# EAGLE design d1mini-sw (EAGLE 8.5.0)
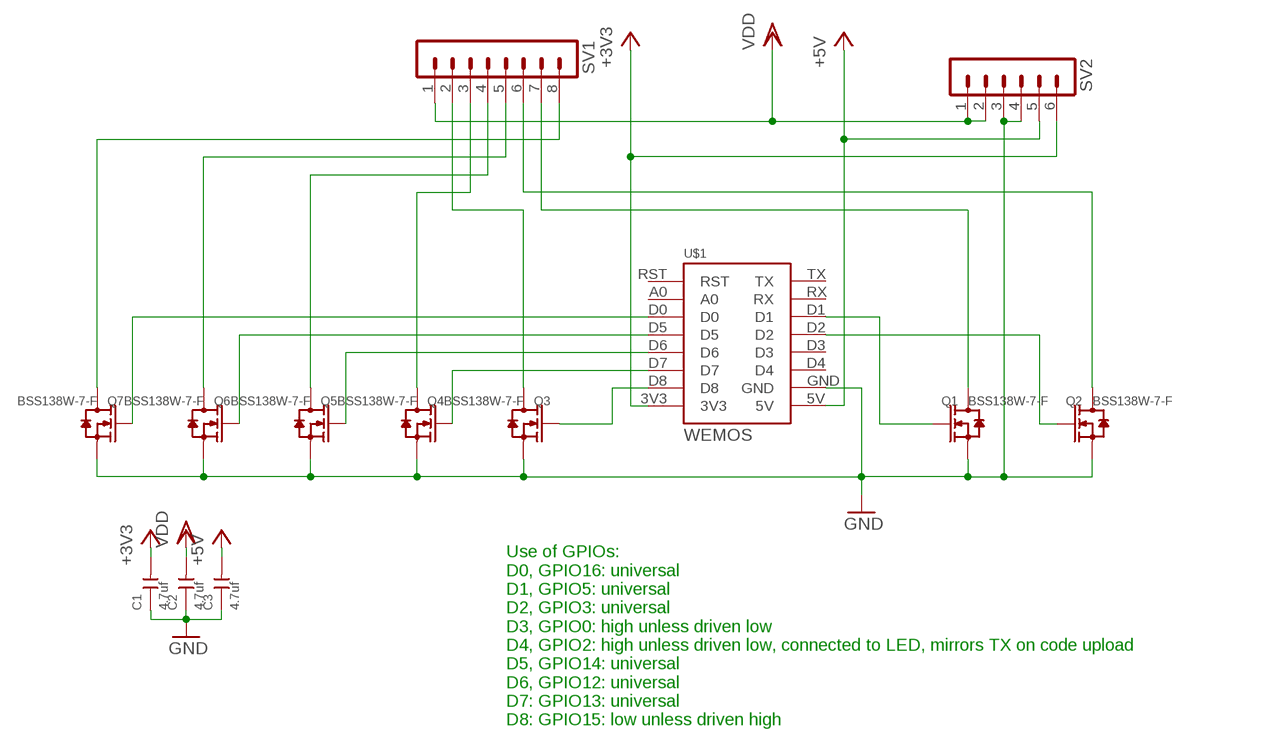
[diagram p0: schematic, sheet 1]

## Parts
C1  4.7uf  CERAMIC-4.7UF-25V-10%-X5R(0805)  [C0805]
C2  4.7uf  CERAMIC-4.7UF-25V-10%-X5R(0805)  [C0805]
C3  4.7uf  CERAMIC-4.7UF-25V-10%-X5R(0805)  [C0805]
Q1  BSS138W-7-F  SMD-MOSFET-N-CH-50V-200MA-BSS138W-7-F(SOT-23)  [SOT-23]
Q2  BSS138W-7-F  SMD-MOSFET-N-CH-50V-200MA-BSS138W-7-F(SOT-23)  [SOT-23]
Q3  BSS138W-7-F  SMD-MOSFET-N-CH-50V-200MA-BSS138W-7-F(SOT-23)  [SOT-23]
Q4  BSS138W-7-F  SMD-MOSFET-N-CH-50V-200MA-BSS138W-7-F(SOT-23)  [SOT-23]
Q5  BSS138W-7-F  SMD-MOSFET-N-CH-50V-200MA-BSS138W-7-F(SOT-23)  [SOT-23]
Q6  BSS138W-7-F  SMD-MOSFET-N-CH-50V-200MA-BSS138W-7-F(SOT-23)  [SOT-23]
Q7  BSS138W-7-F  SMD-MOSFET-N-CH-50V-200MA-BSS138W-7-F(SOT-23)  [SOT-23]
SV1  MA08-1  [MA08-1]
SV2  MA06-1  [MA06-1]
U$1  WEMOS  [WEMOS]

## Nets
+3V3: C1.2 SV2.6 U$1.3V3
+5V: C3.2 SV2.5 U$1.5V
D0: Q7.1(G) U$1.D0
D1: Q1.1(G) U$1.D1
D2: Q2.1(G) U$1.D2
D5: Q6.1(G) U$1.D5
D6: Q5.1(G) U$1.D6
D7: Q4.1(G) U$1.D7
D8: Q3.1(G) U$1.D8
GND: C1.1 C2.1 C3.1 Q1.2(S) Q2.2(S) Q3.2(S) Q4.2(S) Q5.2(S) Q6.2(S) Q7.2(S) SV2.3 SV2.4 U$1.GND
P0: Q7.3(D) SV1.8
P1: Q1.3(D) SV1.7
P2: Q2.3(D) SV1.6
P5: Q6.3(D) SV1.5
P6: Q5.3(D) SV1.4
P7: Q4.3(D) SV1.3
P8: Q3.3(D) SV1.2
VDD: C2.2 SV1.1 SV2.1 SV2.2
Unconnected: U$1.A0 U$1.D3 U$1.D4 U$1.RST U$1.RX U$1.TX

## Notes on the sheet
- Use of GPIOs:
  D0, GPIO16: universal
  D1, GPIO5: universal
  D2, GPIO3: universal
  D3, GPIO0: high unless driven low
  D4, GPIO2: high unless driven low, connected to LED, mirrors TX on code upload
  D5, GPIO14: universal
  D6, GPIO12: universal
  D7: GPIO13: universal
  D8: GPIO15: low unless driven high

## Library data of the parts
C1-C3 = Seeed-Capacitor-2016:CERAMIC-4.7UF-25V-10%-X5R(0805): 302010146; MPN: CC0805KKX5R8BB475
Q1-Q7 = Seeed-Transistor-2016:SMD-MOSFET-N-CH-50V-200MA-BSS138W-7-F(SOT-23): 305030000; MPN: BSS138W-7-F
SV1 = con-lstb:MA08-1: PIN HEADER; OC_FARNELL: unknown; OC_NEWARK: unknown
SV2 = con-lstb:MA06-1: PIN HEADER; OC_FARNELL: unknown; OC_NEWARK: unknown
U$1 = WeMos D1 Mini Pro:WEMOS

## Board
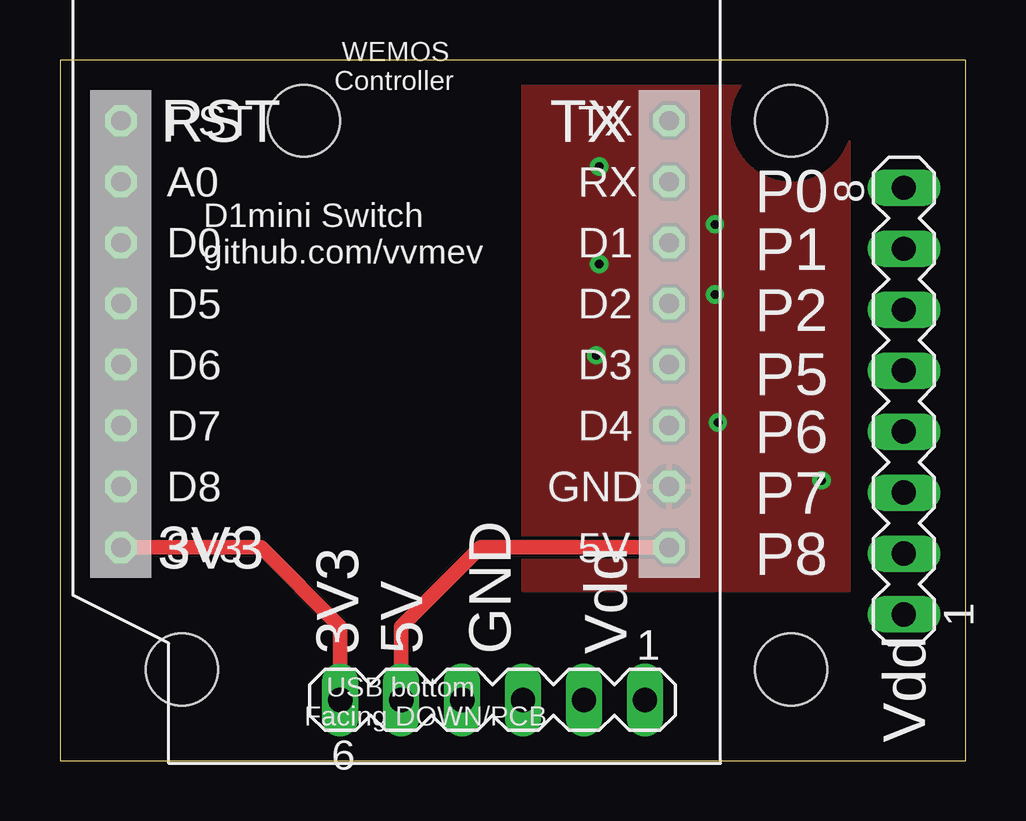
[diagram p1: board, top side]
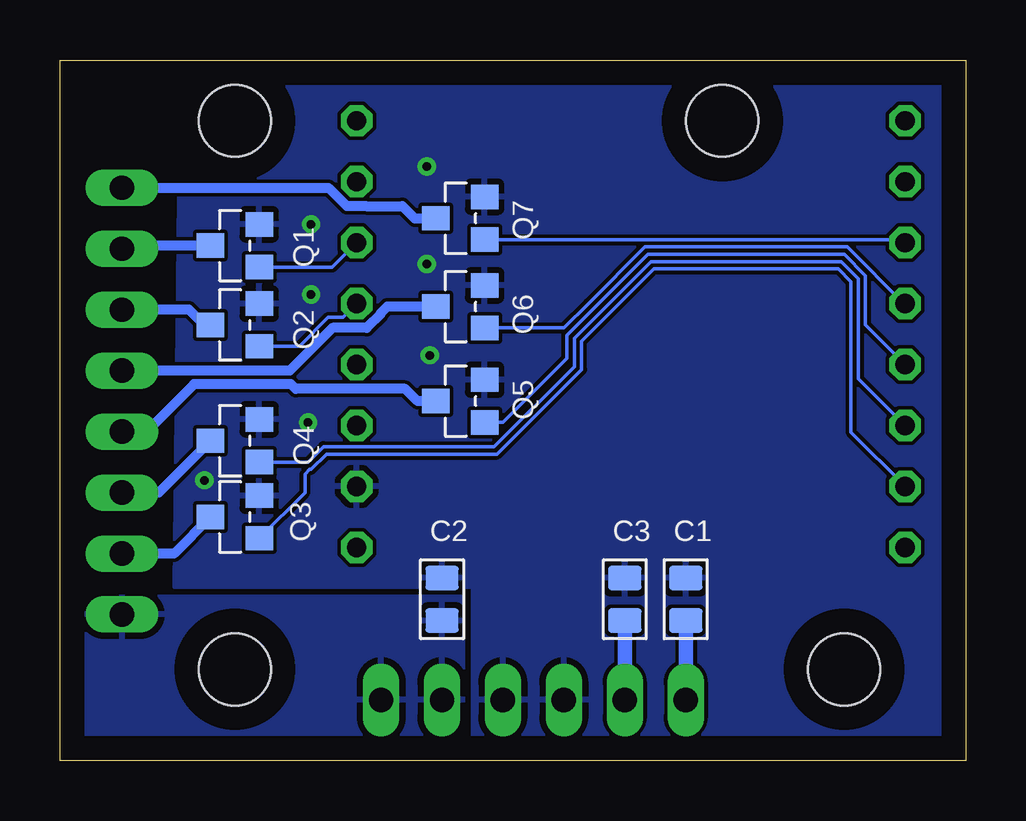
[diagram p2: board, bottom side, seen from below]

Size 37.77 x 29.2 mm. Coordinates in mm from the lower left corner, seen from the top.
Outline: 0,0 37.77,0 37.77,29.2 0,29.2 0,0
Copper layers (1*16): Top 0.035mm / dielectric 1.5mm / Bottom 0.035mm
Design rules "default *": minimum track width 6mil, minimum drill 0.35mm, track to track 6mil, track to pad 6mil, pad to pad 6mil, via to via 6mil, smd to smd 6mil, copper to edge 40mil, drill to drill 6mil, minimum pad ring 10mil, minimum via ring 8mil, stop-mask expansion 4mil, vias tented up to drill 20mil, thermal gap 10mil
Holes 3 mm at 5.08,3.81 10.16,26.67 30.48,26.67 30.48,3.81

### Footprints (pad centres in the part's own frame; a part is rotated, then mirrored left to right if it is on the bottom)
C0805 = smd 1.397 x 1.016: 1 0,0.889; 2 0,-0.889
SOT-23 = smd 1.016 x 1.143: 1 -0.889,-1.016; 2 0.889,-1.016; 3 0,1.016
MA08-1 = drill 1.016 long: 1 -8.89,0; 2 -6.35,0; 3 -3.81,0; 4 -1.27,0; 5 1.27,0; 6 3.81,0; 7 6.35,0; 8 8.89,0
MA06-1 = drill 1.016 long: 1 -6.35,0; 2 -3.81,0; 3 -1.27,0; 4 1.27,0; 5 3.81,0; 6 6.35,0
WEMOS = drill 0.8 octagon: 3V3 0,0; 5V 22.86,0; A0 0,15.24; D0 0,12.7; D1 22.86,12.7; D2 22.86,10.16; D3 22.86,7.62; D4 22.86,5.08; D5 0,10.16; D6 0,7.62; D7 0,5.08; D8 0,2.54; GND 22.86,2.54; RST 0,17.78; RX 22.86,15.24; TX 22.86,17.78

### Placement (x,y rotation side)
C1  11.68,6.73 0 bottom
C2  21.84,6.73 0 bottom
C3  14.22,6.73 0 bottom
Q1  30.48,21.46 90 bottom
Q2  30.48,18.16 90 bottom
Q3  30.48,10.16 90 bottom
Q4  30.48,13.34 90 bottom
Q5  21.08,14.99 90 bottom
Q6  21.08,18.92 90 bottom
Q7  21.08,22.61 90 bottom
SV1  35.18,14.99 90 top
SV2  18.03,2.54 180 top
U$1  2.54,8.89 0 top

### Tracks (layer width: path | path; a pad name or v marks a point on that pad's centre or on a via)
+3V3
  Top 0.61: U$1.3V3 8.38,8.89 11.68,5.59 SV2.6
  Bottom 0.61: C1.2 SV2.6
+5V
  Top 0.61: SV2.5 14.22,5.59 17.53,8.89 U$1.5V
  Bottom 0.61: C3.2 SV2.5
D0
  Bottom 0.152: Q7.1 2.67,21.72 U$1.D0
D1
  Bottom 0.152: U$1.D1 26.42,20.57 Q1.1
D2
  Bottom 0.152: Q2.1 27.79,17.27 26.59,18.47 25.98,18.47 U$1.D2
D5
  Bottom 0.152: Q6.1 16.76,18.03 15.75,19.05 13.39,21.41 4.95,21.41 2.59,19.05 U$1.D5
D6
  Bottom 0.152: Q5.1 19.3,14.1 16.64,16.76 16.64,17.73 13.26,21.11 5.08,21.11 4.19,20.22 4.19,18.16 U$1.D6
D7
  Bottom 0.152: Q4.1 27.43,12.45 26.79,13.09 19.67,13.09 16.33,16.43 16.33,17.6 13.13,20.8 5.21,20.8 4.5,20.09 4.5,15.93 U$1.D7
D8
  Bottom 0.152: Q3.1 27.56,11.18 27.56,11.94 27.36,12.14 27.31,12.14 26.66,12.78 19.55,12.78 16.03,16.3 16.03,17.48 13.01,20.5 5.33,20.5 4.8,19.97 4.8,13.69 U$1.D8
GND  (via drill 0.35)
  other vias: 27.43,14.1 27.3,19.43 27.3,22.35 22.48,24.77 22.48,20.7 22.35,16.89 31.75,11.68
  pour Bottom: 0.51,0.38 20.57,0.38 20.57,7.24 33.02,7.24 32.77,28.96 0.51,28.83 0.38,28.7 0.38,11.3
  pour Top: 22.61,28.83 32.77,28.83 32.89,28.83 32.89,7.11 19.3,7.11 19.3,28.83
P0
  Bottom 0.406: Q7.3 22.99,22.61 23.5,23.11 25.02,23.11 25.02,23.12 25.82,23.12 26.57,23.88 SV1.8
P1
  Bottom 0.406: Q1.3 35.05,21.46 SV1.7
P2
  Bottom 0.406: Q2.3 31.75,18.16 32.38,18.8 SV1.6
P5
  Bottom 0.406: Q6.3 24.13,18.92 24.39,18.66 24.39,18.63 24.98,18.04 26.41,18.04 28.19,16.26 SV1.5
P6
  Bottom 0.406: Q5.3 22.86,14.99 23.37,15.5 27.95,15.5 28.14,15.7 32.18,15.7 34.16,13.72 SV1.4
P7
  Bottom 0.406: Q4.3 33.66,11.18 SV1.3
P8
  Bottom 0.406: Q3.3 33.02,8.64 SV1.2
VDD
  pour Bottom: 20.95,0.38 20.95,6.86 37.59,6.86 37.59,0.38

### Text on the board
tNames: TX | RST | P0 | D1mini Switch / github.com/vvmev | P1 | P2 | P5 | P6 | P7 | 3V3 | P8 | 3V3 | 5V | GND | Vdd | Vdd